# EAGLE schematic PCBROCKET (EAGLE 9.6.2)
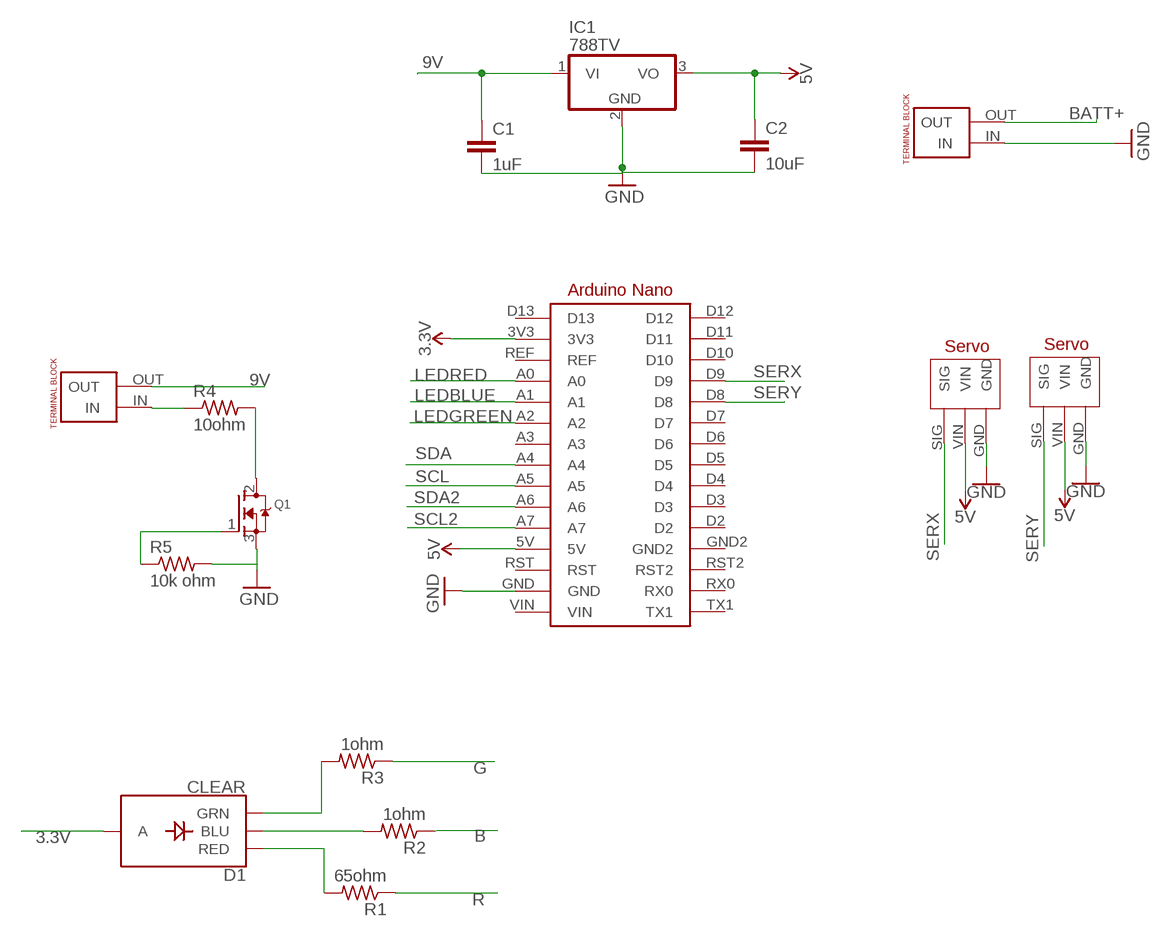
[diagram p0: schematic, sheet 1]

## Parts
C1  1uF  C2,5-3  [C2.5-3]
C2  10uF  C2,5-3  [C2.5-3]
D1  CLEAR  LED-RGB-CACLEAR  [LED-RGB-THRU]
IC1  788TV  [TO220V]
Q1  MOSFET-NGDS_TO220V  [TO220V]
R1  65ohm  R-US_0204/2V  [0204V]
R2  1ohm  R-US_0204/2V  [0204V]
R3  1ohm  R-US_0204/2V  [0204V]
R4  10ohm  R-US_0204/2V  [0204V]
R5  10k ohm  R-US_0204/2V  [0204V]
U$1  TERMINAL_BLOCK  [TERMINAL_BLOCK]
U$4  ARDUINO_NANO  [ARDUINO_NANO]
U$5  MG90S  [MG90S]
U$6  MG90S  [MG90S]
U$7  TERMINAL_BLOCK  [TERMINAL_BLOCK]

## Nets
3.3V: D1.2(A) U$4.3V3
5V: C2.1 IC1.3(VO) U$4.5V U$5.VIN U$6.VIN
9V: C1.1 IC1.1(VI) U$7.OUT
B: R2.1
BATT+: U$1.OUT
G: R3.1
GND: C1.2 C2.2 IC1.2(GND) Q1.3(S) U$1.IN U$4.GND U$5.GND U$6.GND
LEDBLUE: U$4.A1
LEDGREEN: U$4.A2
LEDRED: U$4.A0
N$3: D1.1(RED) R1.2
N$4: D1.4(BLU) R2.2
N$5: D1.3(GRN) R3.2
N$6: R4.1 U$7.IN
N$7: Q1.2(D) R4.2
N$8: R5.2
N$9: Q1.1(G) R5.1
R: R1.1
SCL: U$4.A5
SCL2: U$4.A7
SDA: U$4.A4
SDA2: U$4.A6
SERX: U$4.D9 U$5.SIG
SERY: U$4.D8 U$6.SIG
Unconnected: U$4.A3 U$4.D2 U$4.D3 U$4.D4 U$4.D5 U$4.D6 U$4.D7 U$4.D10 U$4.D11 U$4.D12 U$4.D13 U$4.GND2 U$4.REF U$4.RST U$4.RST2 U$4.RX0 U$4.TX1 U$4.VIN

## Library data of the parts
C1 C2 = capacitor-wima:C: CAPACITOR naming: grid - package width
D1 = SparkFun-LED:LED-RGB-CA: LED-RGB Diffused Common Anode Packages: LED RGB-THRU P-LCC-4-3 LED-TRICOLOR-SMD SparkFun Products: RGB Diffused Common Anode- Diffuse <[https://www.sparkfun.com/products/10821]> RGB Diffused Common Anode - Clear <[https://www.sparkfun.com/products/10820]> Qduino Mini <[https://www.sparkfun.com/products/13614]> Triple Output LED RGB - SMD <https://www.sparkfun.com/products/7844>; PROD_ID: DIO-10631
IC1 = linear:78*: Positive VOLTAGE REGULATOR Source: http://cache.national.com/ds/LM/LM78L05.pdf http://www.fairchildsemi.com/ds/LM/LM7805.pdf
Q1 = adafruit:MOSFET-N: N-Channel Mosfet 2N7002E - 60V 260mA SOT23 [Digikey: 2N7002ET1GOSTR-ND] - REEL BSH103 - 30V 850mA SOT23 [Digikey: 568-5013-1-ND]
R1-R5 = resistor:R-US_: RESISTOR, American symbol
U$1 U$7 = TERMINAL_BLOCK:TERMINAL_BLOCK
U$4 = ARDUINO_NANO:ARDUINO_NANO
U$5 U$6 = MG90S:MG90S